# Altium schematic sheet PART7_op_amp.SchDoc
size A4
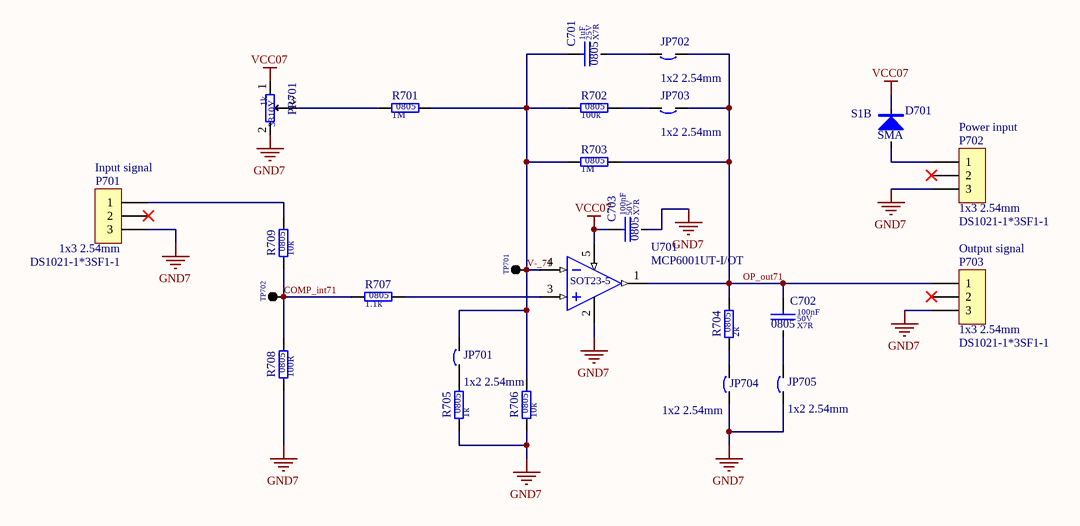
[diagram p0: PART7_op_amp.SchDoc]

## Parts
C701  value 1uF  Dielectric: X7R  Voltage: 25V  SCH_Footprint: 0805  [C_0805_2012]  (hidden comment: Ceramic X7R)
C702  value 100nF  Dielectric: X7R  Voltage: 50V  SCH_Footprint: 0805  [C_0805_2012]  (hidden comment: Ceramic X7R)
C703  value 100nF  Dielectric: X7R  Voltage: 50V  SCH_Footprint: 0805  [C_0805_2012]  (hidden comment: Ceramic X7R)
D701  value S1B  SCH_Footprint: SMA  [SMA_DO-214AC]
JP701  SCH_Footprint: 1x2 2.54mm  [P_HEADER_1x2_2.54]  (hidden comment: Goldpin)
JP702  SCH_Footprint: 1x2 2.54mm  [P_HEADER_1x2_2.54]  (hidden comment: Goldpin)
JP703  SCH_Footprint: 1x2 2.54mm  [P_HEADER_1x2_2.54]  (hidden comment: Goldpin)
JP704  SCH_Footprint: 1x2 2.54mm  [P_HEADER_1x2_2.54]  (hidden comment: Goldpin)
JP705  SCH_Footprint: 1x2 2.54mm  [P_HEADER_1x2_2.54]  (hidden comment: Goldpin)
P701  Input signal  value DS1021-1*3SF1-1  SCH_Footprint: 1x3 2.54mm  [P_HEADER_1x3_2.54]
P702  Power input  value DS1021-1*3SF1-1  SCH_Footprint: 1x3 2.54mm  [P_HEADER_1x3_2.54]
P703  Output signal  value DS1021-1*3SF1-1  SCH_Footprint: 1x3 2.54mm  [P_HEADER_1x3_2.54]
PR701  value 1k  [3310Y]  (hidden comment: Resistor)
R701  value 1M  SCH_Footprint: 0805  [R_0805_2012]  (hidden comment: Resistor)
R702  value 100k  SCH_Footprint: 0805  [R_0805_2012]  (hidden comment: Resistor)
R703  value 1M  SCH_Footprint: 0805  [R_0805_2012]  (hidden comment: Resistor)
R704  value 2k  SCH_Footprint: 0805  [R_0805_2012]  (hidden comment: Resistor)
R705  value 1k  SCH_Footprint: 0805  [R_0805_2012]  (hidden comment: Resistor)
R706  value 10k  SCH_Footprint: 0805  [R_0805_2012]  (hidden comment: Resistor)
R707  value 1.1k  SCH_Footprint: 0805  [R_0805_2012]  (hidden comment: Resistor)
R708  value 100R  SCH_Footprint: 0805  [R_0805_2012]  (hidden comment: Resistor)
R709  value 10k  SCH_Footprint: 0805  [R_0805_2012]  (hidden comment: Resistor)
TP701  Single pin  [TP_1PIN]  (value not drawn)
TP702  Single pin  [TP_1PIN]  (value not drawn)
U701  value MCP6001UT-I/OT  SCH_Footprint: SOT23-5  [SOT23-5_SC74A_SOT753_M]  (hidden comment: MCP6001UT-IOT)

## Nets
GND7: C703.2 JP704.1 JP705.1 P701.3 P702.3 P703.3 PR701.2 R705.1 R706.1 R708.1 U701.2(GND)
VCC07: C703.1 D701.1 PR701.1 U701.5(VDD)
COMP_int71: R707.1 R708.2 R709.1 TP702.1(TP)
OP_out71: C702.1 JP702.1 JP703.1 P703.1 R703.2 R704.2 U701.1(OUT)
V-_71: C701.1 JP701.2 R701.2 R702.1 R703.1 R706.2 TP701.1(TP) U701.4(IN-)
NetC701_2: C701.2 JP702.2
NetC702_2: C702.2 JP705.2
NetD701_2: D701.2 P702.1
NetJP701_1: JP701.1 R705.2
NetJP703_2: JP703.2 R702.2
NetJP704_2: JP704.2 R704.1
NetP701_1: P701.1 R709.2
NetPR701_3: PR701.3 R701.1
NetR707_2: R707.2 U701.3(IN+)

Not connected (* = marked no-connect by the designer): P701 2*; P702 2*; P703 2*

## Library data of the parts
C701 = C_1uF_25V_X7R_0805_10: Capacitor; Manufacturer: AVX; Manufacturer Part Number: 08053C105KAT2A; Tolerance (%): 10; Part Number: C_1uF_25V_X7R_0805_10; HelpURL: https://www.tme.eu/Document/667fe6e7748c0ed1675574c6bf64b751/AVX_X7R.pdf; Supplier 1: TME; Supplier Part Number 1: 08053C105KAT2A; Supplier 2: RS Components; Supplier Part Number 2: 1351396; Supplier 3: Farnell; Supplier Part Number 3: 1658877; Supplier 4: Mouser; Supplier Part Number 4: 581-08053C105KAT2A; Supplier 5: Digi-Key; Supplier Part Number 5: 478-5030-1-ND
C702 C703 = C_100nF_50V_X7R_0805_10: Capacitor; Manufacturer: AVX; Manufacturer Part Number: 08055C104K4T2A; Tolerance (%): 10; Part Number: C_100nF_50V_X7R_0805_10; HelpURL: http://www.tme.eu/pl/Document/943bdb20b23b898c4d4b2ec4eca4f2b6/cauto.pdf; Supplier 1: TME; Supplier Part Number 1: 08055C104K4T2A; Supplier 2: RS Components; Supplier 3: Farnell; Supplier 4: Mouser; Supplier 5: Digi-Key
D701 = D_S1B_1A_100V_SMA: Manufacturer: Vishay/General Semiconductor; Voltage: 100V; Current: 1A; Part Number: D_S1B_1A_100V_SMA; Manufacturer Part Number: S1B; Supplier 1: TME; Supplier 2: RS Components; Supplier 3: Farnell; Supplier 4: Mouser; Supplier Part Number 4: 821-S1B; Supplier 5: Digi-Key; Supplier Part Number 5: S1B/51GI
JP701-JP705 = CB_GOLDPIN: Circuit Breaker; Part Number: CB_GOLDPIN; Component Type: Standard; Supplier 1: TME; Supplier 2: RS Components; Supplier 3: Farnell; Supplier 4: Mouser; Supplier 5: Digi-Key
P701-P703 = P_HEADER_1x3_2.54: Pin Header; Manufacturer: Connfly; Part Number: P_HEADER_1x3_2.54; Component Type: Standard; HelpURL: http://www.tme.eu/en/Document/cc301e58a5da78cb543a94b5a5b7f06a/DS1021.pdf; Manufacturer Part Number: DS1021-1*3SF1-1; Supplier 1: TME; Supplier Part Number 1: ZL201-03G; Supplier 2: RS Components; Supplier 3: Farnell; Supplier 4: Mouser; Supplier 5: Digi-Key
PR701 = R_1k_3310Y_20: Manufacturer: Bourns; Manufacturer Part Number: 3310Y-001-102L; Voltage: 50V; Power: 250mW; Tolerance: 20%; SCH_Footprint: 3310Y; Part Number: R_1k_3310Y_20; HelpURL: https://docs.rs-online.com/4641/0900766b8069b9f0.pdf; Supplier 1: TME; Supplier Part Number 1: 3310Y-001-102L; Supplier 2: RS Components; Supplier Part Number 2: 522-0603P; Supplier 3: Farnell; Supplier Part Number 3: 1156139; Supplier 4: Mouser; Supplier Part Number 4: 652-3310Y-001-102L; Supplier 5: Digi-Key; Supplier Part Number 5: 3310Y-001-102L-ND
R701 R703 = R_1M_0805_1: Manufacturer: Yageo; Manufacturer Part Number: RC0805FR-071ML; Voltage: 150V; Power: 125mW; Tolerance: 1%; Part Number: R_1M_0805_1; HelpURL: https://pl.mouser.com/datasheet/2/447/PYu-RC_Group_51_RoHS_L_9-1314892.pdf; Supplier 1: TME; Supplier Part Number 1: RC0805FR-071M; Supplier 2: RS Components; Supplier Part Number 2: 618-3729; Supplier 3: Farnell; Supplier Part Number 3: 9237992; Supplier 4: Mouser; Supplier Part Number 4: 603-RC0805FR-071ML; Supplier 5: Digi-Key; Supplier Part Number 5: 311-1.00MCRCT-ND
R702 = R_100k_0805_1: Manufacturer: Yageo; Manufacturer Part Number: RC0805FR-07100KL; Voltage: 150V; Power: 125mW; Tolerance: 1%; Part Number: R_100k_0805_1; HelpURL: https://pl.mouser.com/datasheet/2/447/PYu-RC_Group_51_RoHS_L_9-1314892.pdf; Supplier 1: TME; Supplier Part Number 1: RC0805FR-07100K; Supplier 2: RS Components; Supplier 3: Farnell; Supplier Part Number 3: 9237879; Supplier 4: Mouser; Supplier Part Number 4: 603-RC0805FR-07100KL; Supplier 5: Digi-Key; Supplier Part Number 5: 311-100KCRCT-ND
R704 = R_2k_0805_1: Manufacturer: Royalohm; Manufacturer Part Number: HP05W3F2001T5E; Voltage: 150V; Power: 300mW; Tolerance: 1%; Part Number: R_2k_0805_1; HelpURL: https://www.tme.eu/pl/Document/fa390a0a31e891a154d3713216995c6e/HighPowerHP.pdf; Supplier 1: TME; Supplier Part Number 1: HP05-2K1%; Supplier 2: RS Components; Supplier 3: Farnell; Supplier 4: Mouser; Supplier 5: Digi-Key
R705 = R_1k_0805_1: Manufacturer: Royalohm; Manufacturer Part Number: HP05W3F1001T5E; Voltage: 150V; Power: 300mW; Tolerance: 1%; Part Number: R_1k_0805_1; HelpURL: https://www.tme.eu/pl/Document/63d5a2fbb689d2d511047d7cc8640cd8/chip_resistor_hp.pdf; Supplier 1: TME; Supplier Part Number 1: HP05-1K1%; Supplier 2: RS Components; Supplier 3: Farnell; Supplier 4: Mouser; Supplier 5: Digi-Key
R706 R709 = R_10k_0805_1: Manufacturer: Royalohm; Manufacturer Part Number: 0805S8F1002T5E; Voltage: 150V; Power: 125mW; Tolerance: 1%; Part Number: R_10k_0805_1; HelpURL: http://www.tme.eu/pl/Document/b315665a56acbc42df513c99b390ad98/ROYALOHM-THICKFILM.pdf; Supplier 1: TME; Supplier Part Number 1: SMD0805-10K-1%; Supplier 2: RS Components; Supplier 3: Farnell; Supplier 4: Mouser; Supplier 5: Digi-Key
R707 = R_1.1k_0805_1: Manufacturer: Yageo; Manufacturer Part Number: RC0805FR-071K1L; Voltage: 150V; Power: 125mW; Tolerance: 1%; Part Number: R_1.1k_0805_1; HelpURL: https://pl.mouser.com/datasheet/2/447/PYu-RC_Group_51_RoHS_L_9-1314892.pdf; Supplier 1: TME; Supplier Part Number 1: RC0805FR-071K1L; Supplier 2: RS Components; Supplier 3: Farnell; Supplier 4: Mouser; Supplier Part Number 4: 603-RC0805FR-071K1L; Supplier 5: Digi-Key; Supplier Part Number 5: 311-1.10KCRCT-ND
R708 = R_100R_0805_1: Manufacturer: Yageo; Manufacturer Part Number: RC0805FR-07100RL; Voltage: 150V; Power: 125mW; Tolerance: 1%; Part Number: R_100R_0805_1; HelpURL: https://www.tme.eu/pl/Document/7b8fed8c112f8a94930279c22c957f7f/rc0805yageo.pdf; Supplier 1: TME; Supplier Part Number 1: RC0805FR-07100R; Supplier 2: RS Components; Supplier Part Number 2: 618-5135; Supplier 3: Farnell; Supplier Part Number 3: 9237364; Supplier 4: Mouser; Supplier Part Number 4: 603-RC0805FR-07100RL; Supplier 5: Digi-Key; Supplier Part Number 5: 311-100CRCT-ND
TP701 TP702 = TP_1PIN: Testpoint; SCH_Footprint: Single; Part Number: TP_1PIN; Component Type: Standard; Supplier 1: TME; Supplier 2: RS Components; Supplier 3: Farnell; Supplier 4: Mouser; Supplier 5: Digi-Key
U701 = A_MCP6001UT-IOT: Manufacturer: Microchip; Part Number: A_MCP6001UT-IOT; HelpURL: https://datasheet.octopart.com/MCP6001UT-I/OT-Microchip-datasheet-8823409.pdf; Manufacturer Part Number: MCP6001UT-I/OT; Supplier 1: TME; Supplier 2: RS Components; Supplier 3: Farnell; Supplier 4: Mouser; Supplier 5: Digi-Key